# Altium schematic sheet 64XkeySchem.SchDoc
size Legal
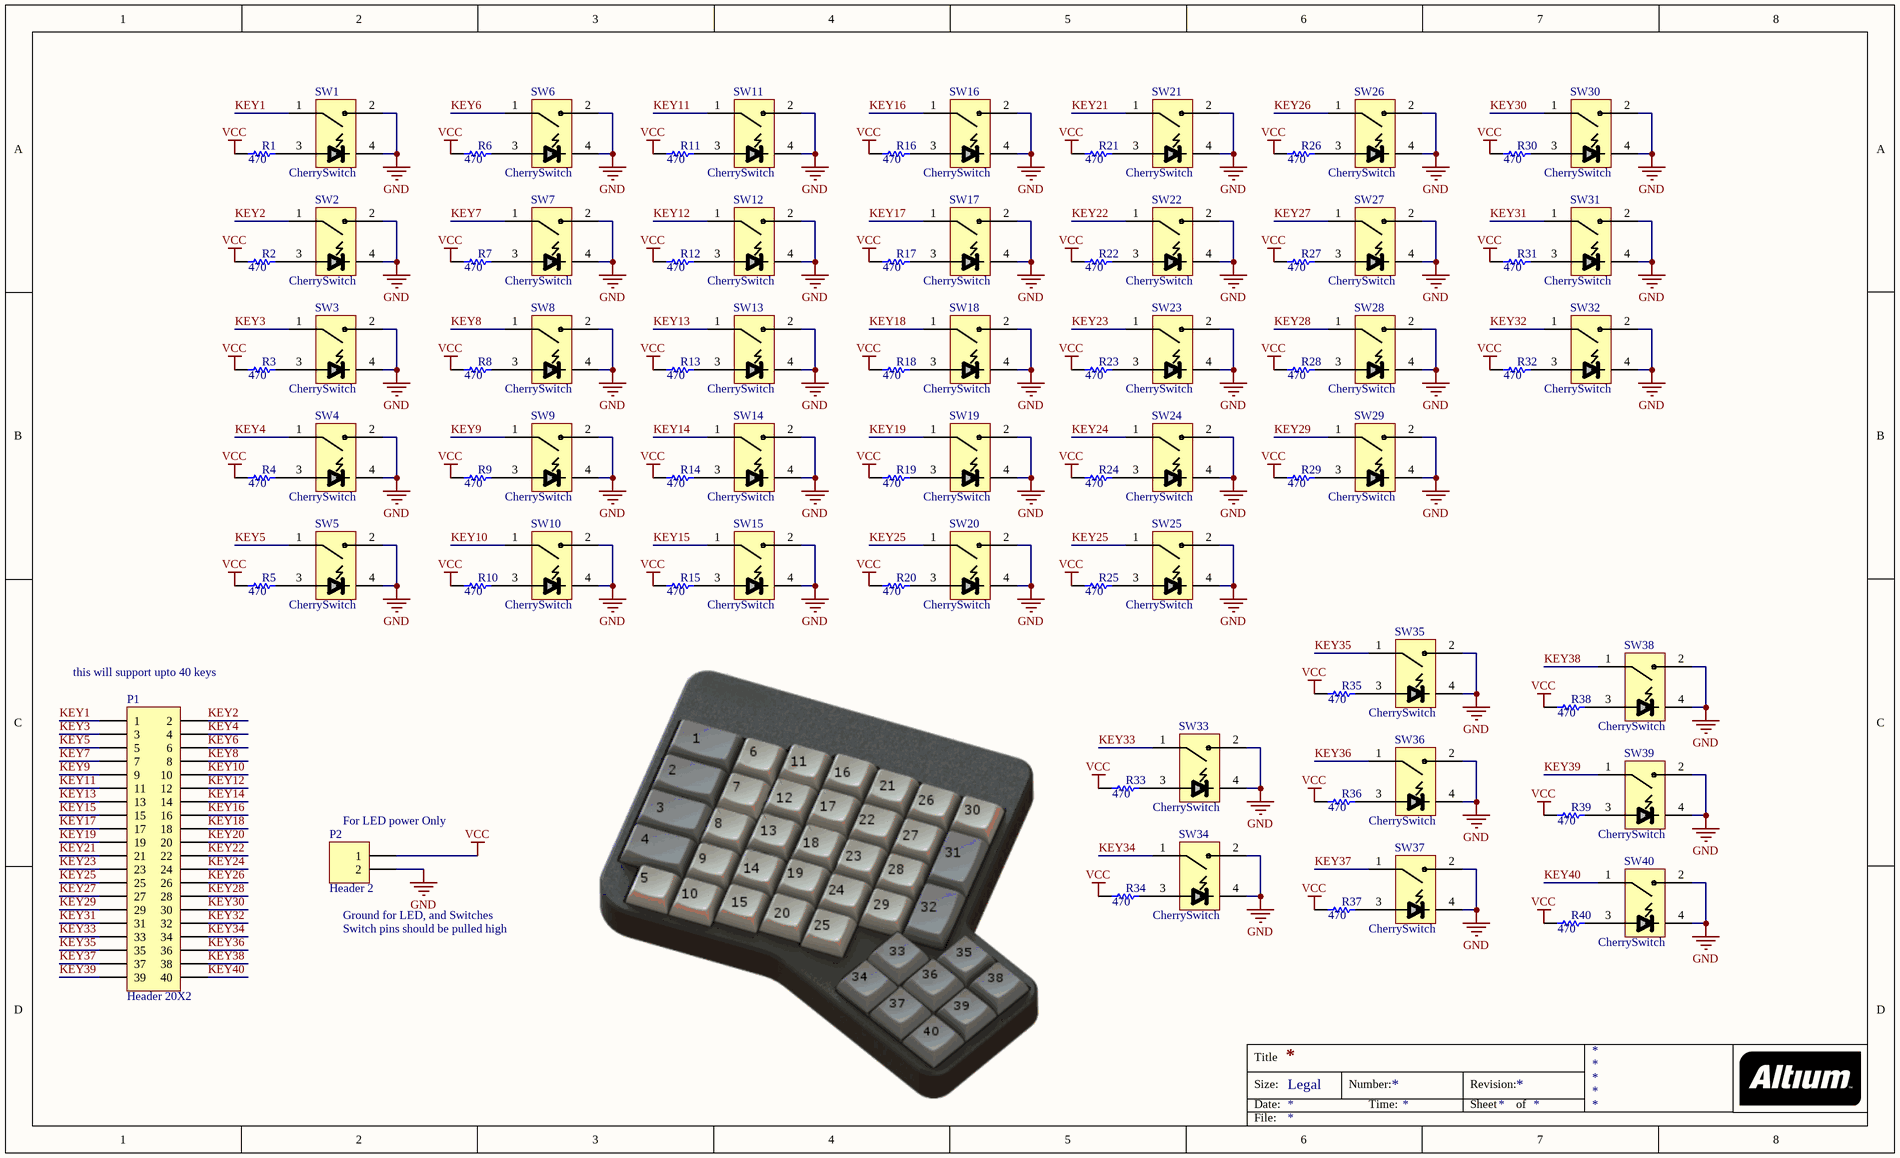
[diagram p0: 64XkeySchem.SchDoc]

## Parts
P1  Header 20X2  [HDR2X20]
P2  Header 2  [HDR1X2]
R1  value 470  [6-0805_N]  (hidden comment: Res Semi)
R2  value 470  [6-0805_N]  (hidden comment: Res Semi)
R3  value 470  [6-0805_N]  (hidden comment: Res Semi)
R4  value 470  [6-0805_N]  (hidden comment: Res Semi)
R5  value 470  [6-0805_N]  (hidden comment: Res Semi)
R6  value 470  [6-0805_N]  (hidden comment: Res Semi)
R7  value 470  [6-0805_N]  (hidden comment: Res Semi)
R8  value 470  [6-0805_N]  (hidden comment: Res Semi)
R9  value 470  [6-0805_N]  (hidden comment: Res Semi)
R10  value 470  [6-0805_N]  (hidden comment: Res Semi)
R11  value 470  [6-0805_N]  (hidden comment: Res Semi)
R12  value 470  [6-0805_N]  (hidden comment: Res Semi)
R13  value 470  [6-0805_N]  (hidden comment: Res Semi)
R14  value 470  [6-0805_N]  (hidden comment: Res Semi)
R15  value 470  [6-0805_N]  (hidden comment: Res Semi)
R16  value 470  [6-0805_N]  (hidden comment: Res Semi)
R17  value 470  [6-0805_N]  (hidden comment: Res Semi)
R18  value 470  [6-0805_N]  (hidden comment: Res Semi)
R19  value 470  [6-0805_N]  (hidden comment: Res Semi)
R20  value 470  [6-0805_N]  (hidden comment: Res Semi)
R21  value 470  [6-0805_N]  (hidden comment: Res Semi)
R22  value 470  [6-0805_N]  (hidden comment: Res Semi)
R23  value 470  [6-0805_N]  (hidden comment: Res Semi)
R24  value 470  [6-0805_N]  (hidden comment: Res Semi)
R25  value 470  [6-0805_N]  (hidden comment: Res Semi)
R26  value 470  [6-0805_N]  (hidden comment: Res Semi)
R27  value 470  [6-0805_N]  (hidden comment: Res Semi)
R28  value 470  [6-0805_N]  (hidden comment: Res Semi)
R29  value 470  [6-0805_N]  (hidden comment: Res Semi)
R30  value 470  [6-0805_N]  (hidden comment: Res Semi)
R31  value 470  [6-0805_N]  (hidden comment: Res Semi)
R32  value 470  [6-0805_N]  (hidden comment: Res Semi)
R33  value 470  [6-0805_N]  (hidden comment: Res Semi)
R34  value 470  [6-0805_N]  (hidden comment: Res Semi)
R35  value 470  [6-0805_N]  (hidden comment: Res Semi)
R36  value 470  [6-0805_N]  (hidden comment: Res Semi)
R37  value 470  [6-0805_N]  (hidden comment: Res Semi)
R38  value 470  [6-0805_N]  (hidden comment: Res Semi)
R39  value 470  [6-0805_N]  (hidden comment: Res Semi)
R40  value 470  [6-0805_N]  (hidden comment: Res Semi)
SW1  CherrySwitch  [CherryMxSwitch]
SW2  CherrySwitch  [CherryMxSwitch]
SW3  CherrySwitch  [CherryMxSwitch]
SW4  CherrySwitch  [CherryMxSwitch]
SW5  CherrySwitch  [CherryMxSwitch]
SW6  CherrySwitch  [CherryMxSwitch]
SW7  CherrySwitch  [CherryMxSwitch]
SW8  CherrySwitch  [CherryMxSwitch]
SW9  CherrySwitch  [CherryMxSwitch]
SW10  CherrySwitch  [CherryMxSwitch]
SW11  CherrySwitch  [CherryMxSwitch]
SW12  CherrySwitch  [CherryMxSwitch]
SW13  CherrySwitch  [CherryMxSwitch]
SW14  CherrySwitch  [CherryMxSwitch]
SW15  CherrySwitch  [CherryMxSwitch]
SW16  CherrySwitch  [CherryMxSwitch]
SW17  CherrySwitch  [CherryMxSwitch]
SW18  CherrySwitch  [CherryMxSwitch]
SW19  CherrySwitch  [CherryMxSwitch]
SW20  CherrySwitch  [CherryMxSwitch]
SW21  CherrySwitch  [CherryMxSwitch]
SW22  CherrySwitch  [CherryMxSwitch]
SW23  CherrySwitch  [CherryMxSwitch]
SW24  CherrySwitch  [CherryMxSwitch]
SW25  CherrySwitch  [CherryMxSwitch]
SW26  CherrySwitch  [CherryMxSwitch]
SW27  CherrySwitch  [CherryMxSwitch]
SW28  CherrySwitch  [CherryMxSwitch]
SW29  CherrySwitch  [CherryMxSwitch]
SW30  CherrySwitch  [CherryMxSwitch]
SW31  CherrySwitch  [CherryMxSwitch]
SW32  CherrySwitch  [CherryMxSwitch]
SW33  CherrySwitch  [CherryMxSwitch]
SW34  CherrySwitch  [CherryMxSwitch]
SW35  CherrySwitch  [CherryMxSwitch]
SW36  CherrySwitch  [CherryMxSwitch]
SW37  CherrySwitch  [CherryMxSwitch]
SW38  CherrySwitch  [CherryMxSwitch]
SW39  CherrySwitch  [CherryMxSwitch]
SW40  CherrySwitch  [CherryMxSwitch]

## Nets
GND: P2.2 SW1.2 SW1.4 SW2.2 SW2.4 SW3.2 SW3.4 SW4.2 SW4.4 SW5.2 SW5.4 SW6.2 SW6.4 SW7.2 SW7.4 SW8.2 SW8.4 SW9.2 SW9.4 SW10.2 SW10.4 SW11.2 SW11.4 SW12.2 SW12.4 SW13.2 SW13.4 SW14.2 SW14.4 SW15.2 SW15.4 SW16.2 SW16.4 SW17.2 SW17.4 SW18.2 SW18.4 SW19.2 SW19.4 SW20.2 SW20.4 SW21.2 SW21.4 SW22.2 SW22.4 SW23.2 SW23.4 SW24.2 SW24.4 SW25.2 SW25.4 SW26.2 SW26.4 SW27.2 SW27.4 SW28.2 SW28.4 SW29.2 SW29.4 SW30.2 SW30.4 SW31.2 SW31.4 SW32.2 SW32.4 SW33.2 SW33.4 SW34.2 SW34.4 SW35.2 SW35.4 SW36.2 SW36.4 SW37.2 SW37.4 SW38.2 SW38.4 SW39.2 SW39.4 SW40.2 SW40.4
VCC: P2.1 R1.1 R2.1 R3.1 R4.1 R5.1 R6.1 R7.1 R8.1 R9.1 R10.1 R11.1 R12.1 R13.1 R14.1 R15.1 R16.1 R17.1 R18.1 R19.1 R20.1 R21.1 R22.1 R23.1 R24.1 R25.1 R26.1 R27.1 R28.1 R29.1 R30.1 R31.1 R32.1 R33.1 R34.1 R35.1 R36.1 R37.1 R38.1 R39.1 R40.1
KEY1: P1.1 SW1.1
KEY2: P1.2 SW2.1
KEY3: P1.3 SW3.1
KEY4: P1.4 SW4.1
KEY5: P1.5 SW5.1
KEY6: P1.6 SW6.1
KEY7: P1.7 SW7.1
KEY8: P1.8 SW8.1
KEY9: P1.9 SW9.1
KEY10: P1.10 SW10.1
KEY11: P1.11 SW11.1
KEY12: P1.12 SW12.1
KEY13: P1.13 SW13.1
KEY14: P1.14 SW14.1
KEY15: P1.15 SW15.1
KEY16: P1.16 SW16.1
KEY17: P1.17 SW17.1
KEY18: P1.18 SW18.1
KEY19: P1.19 SW19.1
KEY20: P1.20
KEY21: P1.21 SW21.1
KEY22: P1.22 SW22.1
KEY23: P1.23 SW23.1
KEY24: P1.24 SW24.1
KEY25: P1.25 SW20.1 SW25.1
KEY26: P1.26 SW26.1
KEY27: P1.27 SW27.1
KEY28: P1.28 SW28.1
KEY29: P1.29 SW29.1
KEY30: P1.30 SW30.1
KEY31: P1.31 SW31.1
KEY32: P1.32 SW32.1
KEY33: P1.33 SW33.1
KEY34: P1.34 SW34.1
KEY35: P1.35 SW35.1
KEY36: P1.36 SW36.1
KEY37: P1.37 SW37.1
KEY38: P1.38 SW38.1
KEY39: P1.39 SW39.1
KEY40: P1.40 SW40.1
NetR1_2: R1.2 SW1.3
NetR2_2: R2.2 SW2.3
NetR3_2: R3.2 SW3.3
NetR4_2: R4.2 SW4.3
NetR5_2: R5.2 SW5.3
NetR6_2: R6.2 SW6.3
NetR7_2: R7.2 SW7.3
NetR8_2: R8.2 SW8.3
NetR9_2: R9.2 SW9.3
NetR10_2: R10.2 SW10.3
NetR11_2: R11.2 SW11.3
NetR12_2: R12.2 SW12.3
NetR13_2: R13.2 SW13.3
NetR14_2: R14.2 SW14.3
NetR15_2: R15.2 SW15.3
NetR16_2: R16.2 SW16.3
NetR17_2: R17.2 SW17.3
NetR18_2: R18.2 SW18.3
NetR19_2: R19.2 SW19.3
NetR20_2: R20.2 SW20.3
NetR21_2: R21.2 SW21.3
NetR22_2: R22.2 SW22.3
NetR23_2: R23.2 SW23.3
NetR24_2: R24.2 SW24.3
NetR25_2: R25.2 SW25.3
NetR26_2: R26.2 SW26.3
NetR27_2: R27.2 SW27.3
NetR28_2: R28.2 SW28.3
NetR29_2: R29.2 SW29.3
NetR30_2: R30.2 SW30.3
NetR31_2: R31.2 SW31.3
NetR32_2: R32.2 SW32.3
NetR33_2: R33.2 SW33.3
NetR34_2: R34.2 SW34.3
NetR35_2: R35.2 SW35.3
NetR36_2: R36.2 SW36.3
NetR37_2: R37.2 SW37.3
NetR38_2: R38.2 SW38.3
NetR39_2: R39.2 SW39.3
NetR40_2: R40.2 SW40.3

## Notes on the sheet
- (near P1) this will support upto 40 keys
- (near P2) For LED power Only
- (near P2) Ground for LED, and Switches
- Switch pins should be pulled high
- Title
- Size:
- Date:
- Legal
- Number:
- Time:
- Revision:
- Sheet
- of
- File:

## Library data of the parts
P1 = Header 20X2: Header, 20-Pin, Dual row; LatestRevisionDate: 17-Jul-2002; LatestRevisionNote: Re-released for DXP Platform.; Publisher: Altium Limited
P2 = Header 2: Header, 2-Pin; LatestRevisionDate: 17-Jul-2002; LatestRevisionNote: Re-released for DXP Platform.; Publisher: Altium Limited
R1-R40 = Res Semi: Semiconductor Resistor; Published: 8-Jun-2000; LatestRevisionDate: 17-Jul-2002; LatestRevisionNote: Re-released for DXP Platform.; PackageReference: AXIAL-0.5; Publisher: Altium Limited
SW1-SW40 = CherrySwitch: Cherry MX Switch layout